# EasyEDA Pro project sarah.eprj, board Cockpit
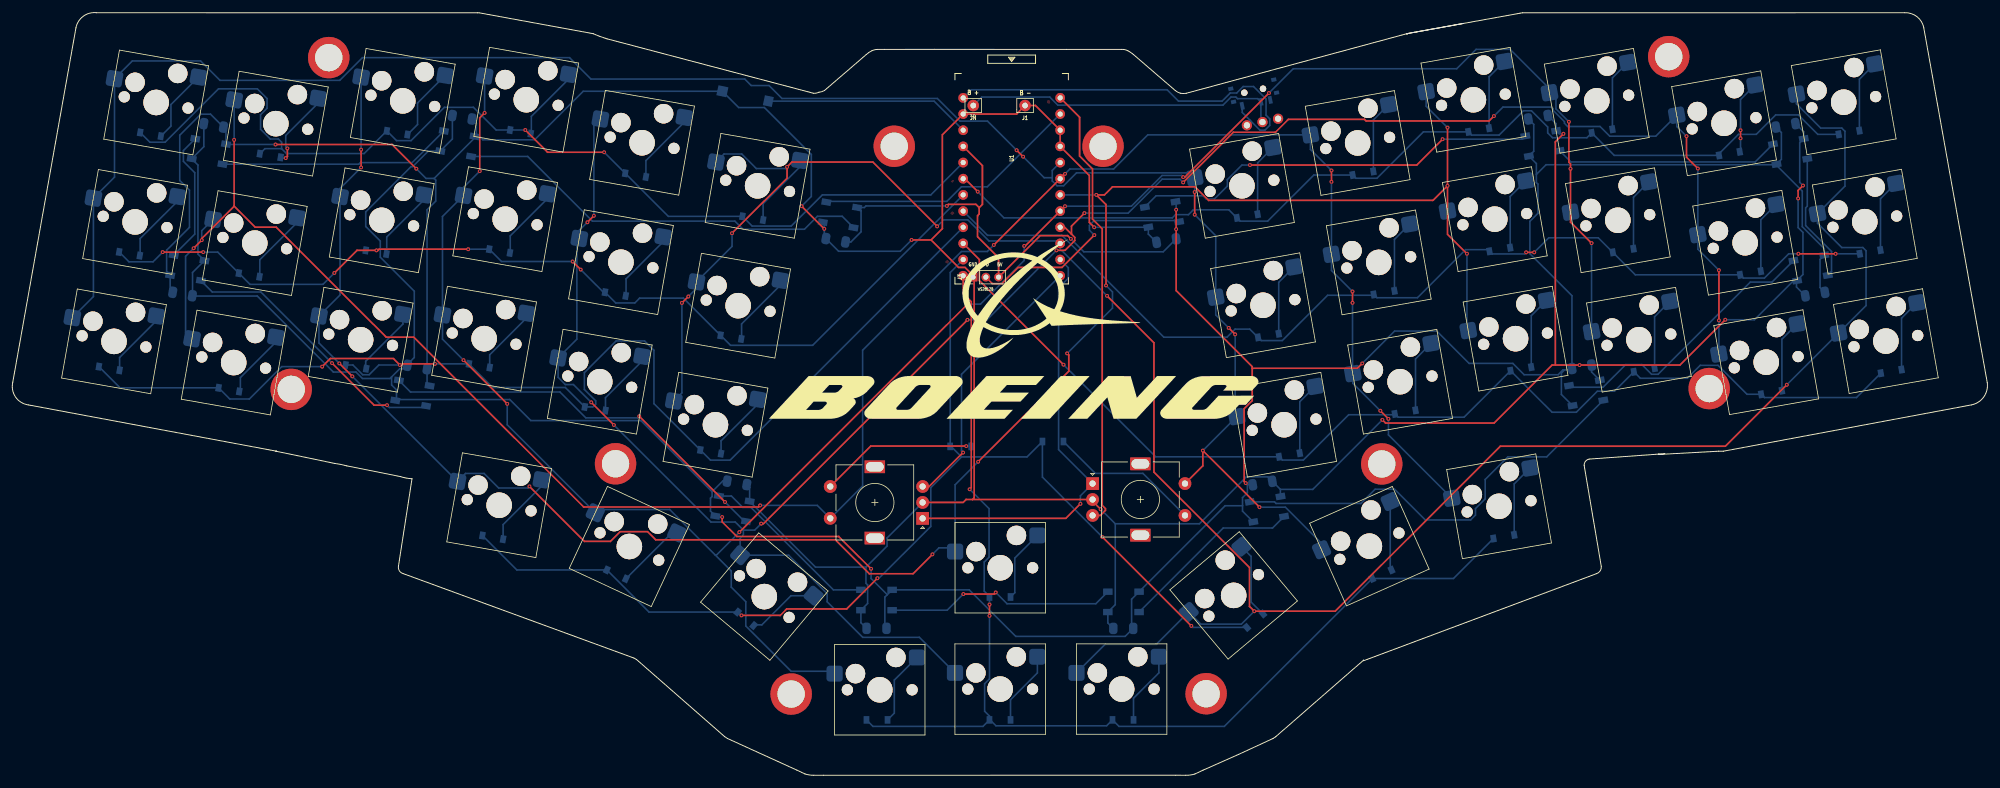
[diagram p1: board, top side]
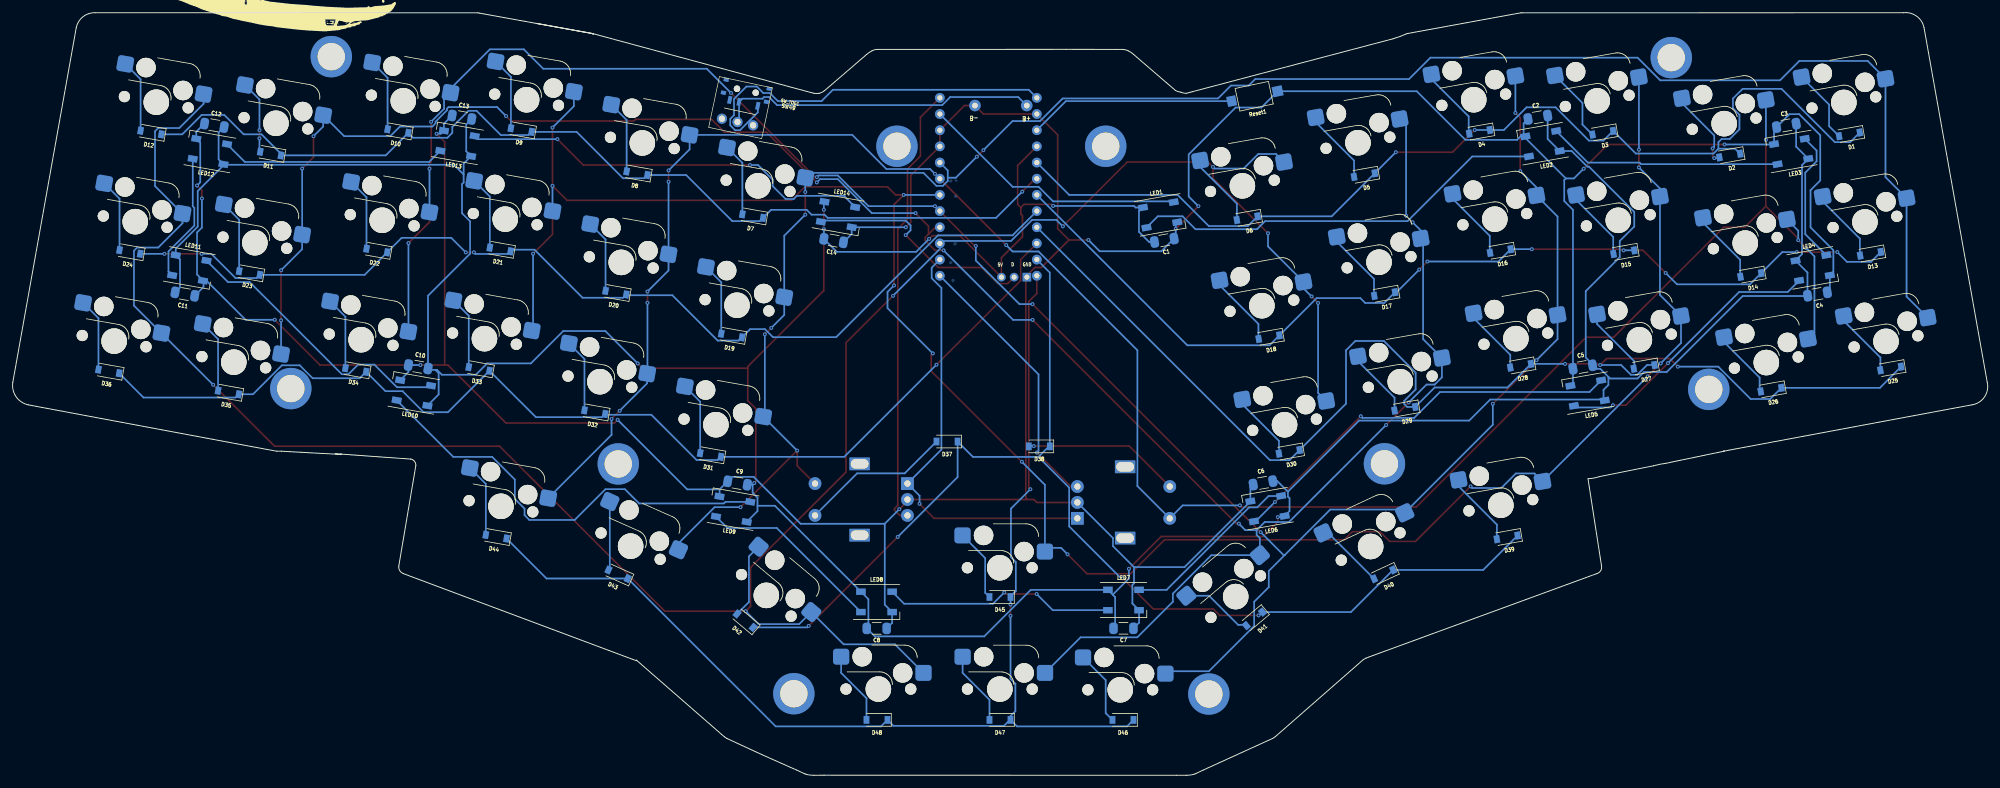
[diagram p2: board, bottom side, seen from below]

Outline 309.97 x 119.78 mm; copper layers: Top Layer, Bottom Layer. Coordinates in mm from the lower left corner of the outline.
Outline path: 41.39,50.91 2.49,58.17 arc(0.51,59.41) 0.07,61.7 9.99,117.41 arc(11.16,119.22) 13.25,119.76 73,119.75 73.26,119.75 91.15,116.47 arc(92.23,116.03) 93.34,115.66 125.75,107.11 arc(126.19,107.14) 126.61,107.28 arc(127.04,107.36) 127.45,107.53 134.02,113.19 arc(134.43,113.52) 134.9,113.79 arc(135.36,113.94) 135.84,114 136.86,114 144.66,114.01 165.44,114 174.13,114 arc(174.61,113.95) 175.07,113.79 arc(175.53,113.52) 175.95,113.19 182.52,107.53 arc(182.9,107.28) 183.33,107.11 arc(183.77,107.07) 184.22,107.11 218.82,116.46 ; 41.39,50.91 41.46,50.9 arc(41.43,50.94) 41.39,50.91 ; 41.39,50.91 arc(41.39,50.9) 41.39,50.89 50.54,48.99 arc(51.5,48.83) 52.44,48.6 60.93,46.91 arc(61.82,46.68) 62.73,46.57 60.61,32.87 arc(60.74,32.13) 61.33,31.68 97.55,18.41 97.98,18.17 111.81,6.06 112.23,5.78 123.12,0.81 124.39,0.21 arc(125.08,0.05) 125.79,0 127.34,0 182.6,0.01 184.18,0 arc(184.89,0.04) 185.58,0.2 186.89,0.81 192.45,3.28 197.89,5.8 198.27,6.05 212.06,18.08 212.08,18 248.64,31.68 arc(249.2,32.13) 249.36,32.82 246.68,48.68 arc(246.9,49.32) 247.48,49.66 258.39,50.44 ; 218.82,116.46 arc(218.82,116.46) 218.82,116.47 ; 218.82,116.46 218.91,116.49 218.93,116.49 arc(218.9,116.37) 218.82,116.46 ; 218.82,116.47 227.74,118.08 218.82,116.47 ; 218.82,116.47 236.65,119.69 236.97,119.75 297.02,119.76 arc(298.93,119.13) 299.98,117.41 309.94,61.66 arc(309.4,59.42) 307.47,58.17 268.51,50.89 arc(268.13,50.89) 267.75,50.89 258.31,50.38 arc(258.35,50.41) 258.39,50.44 ; 258.39,50.44 259.33,50.51 arc(258.87,50.39) 258.39,50.44
Stack: Top Layer 0.0009mm / dielectric 1 0.0384mm FR4 er 4.5 / Bottom Layer 0.0009mm

## Design rules (mm)
spacing safeClearance (default): track to track 0.152, other pairs 0.152 to 0.3
track width trackWidth (default): min 0.127, default 0.254, max 2.54
differential pair differentialPair (default): width min 0.127, default 0.254, max 2.54; gap min 0.152, default 0.152
via viaSize (default): diameter min 0.5, default 0.61, max 10; hole min 0.3, default 0.305, max 6
net COL3 uses CopperRegion517
net ROW6 uses CopperRegion506
net Net-(J2-Pad1) uses CopperRegion393
net COL2 uses CopperRegion507
net RAW uses CopperRegion371
net COL1 uses CopperRegion491
net COL5 uses CopperRegion503
net RST uses CopperRegion444
net COL0 uses CopperRegion471
net Net-(D38-Pad2) uses CopperRegion384
net ROW5 uses CopperRegion438
net COL4 uses CopperRegion482
net ROW0 uses CopperRegion509
net D3 uses CopperRegion355
net ROW1 uses CopperRegion514
net ROW4 uses CopperRegion515
net ROW7 uses CopperRegion502
net D2 uses CopperRegion419
net DOUT uses CopperRegion493
net ROW3 uses CopperRegion485
net ROW2 uses CopperRegion513
net GND uses CopperRegion111
net VCC uses CopperRegion511
net Net-(D33-Pad2) uses CopperRegion294
net Net-(D4-Pad2) uses CopperRegion504
net Net-(D14-Pad2) uses CopperRegion167
net Net-(D28-Pad2) uses CopperRegion210
net Net-(D25-Pad2) uses CopperRegion228
net Net-(LED8-Pad2) uses CopperRegion290
net Net-(LED3-Pad2) uses CopperRegion310
net Net-(D19-Pad2) uses CopperRegion490
net Net-(D46-Pad2) uses CopperRegion293
net Net-(D17-Pad2) uses CopperRegion462
net Net-(D43-Pad2) uses CopperRegion353
net Net-(LED4-Pad2) uses CopperRegion499
net B4 uses CopperRegion436
net Net-(D30-Pad2) uses CopperRegion356
net Net-(D15-Pad2) uses CopperRegion501
net Net-(D24-Pad2) uses CopperRegion257
net Net-(LED12-Pad2) uses CopperRegion318
net Net-(D7-Pad2) uses CopperRegion410
net Net-(LED10-Pad2) uses CopperRegion373
net Net-(D1-Pad2) uses CopperRegion279
net Net-(LED7-Pad2) uses CopperRegion241
net Net-(D12-Pad2) uses CopperRegion272
net Net-(D48-Pad2) uses CopperRegion320
net Net-(D35-Pad2) uses CopperRegion285
net Net-(LED11-Pad2) uses CopperRegion466
net Net-(LED5-Pad2) uses CopperRegion483
net Net-(LED13-Pad2) uses CopperRegion251
net Net-(D36-Pad2) uses CopperRegion344
net Net-(D5-Pad2) uses CopperRegion447
net Net-(D20-Pad2) uses CopperRegion467
net Net-(D31-Pad2) uses CopperRegion337
net Net-(D26-Pad2) uses CopperRegion327
net Net-(LED10-Pad4) uses CopperRegion339
net Net-(D47-Pad2) uses CopperRegion232
net Net-(D39-Pad2) uses CopperRegion488
net Net-(D32-Pad2) uses CopperRegion431
net Net-(D45-Pad2) uses CopperRegion382
net Net-(D10-Pad2) uses CopperRegion246
net Net-(D44-Pad2) uses CopperRegion335
net Net-(D22-Pad2) uses CopperRegion305
net Net-(D8-Pad2) uses CopperRegion454
net Net-(LED1-Pad2) uses CopperRegion324
net Net-(D27-Pad2) uses CopperRegion306
net Net-(D9-Pad2) uses CopperRegion401
net Net-(D21-Pad2) uses CopperRegion400
net Net-(LED6-Pad2) uses CopperRegion346
net Net-(D42-Pad2) uses CopperRegion407
net Net-(D40-Pad2) uses CopperRegion430
net Net-(D23-Pad2) uses CopperRegion457
net Net-(D6-Pad2) uses CopperRegion480
net Net-(D18-Pad2) uses CopperRegion425
net B5 uses CopperRegion481
net Net-(LED2-Pad2) uses CopperRegion477
net Net-(D11-Pad2) uses CopperRegion443
net Net-(D41-Pad2) uses CopperRegion363
net Net-(D37-Pad2) uses CopperRegion381
net Net-(D2-Pad2) uses CopperRegion487
net Net-(D3-Pad2) uses CopperRegion440
net Net-(D16-Pad2) uses CopperRegion508
net Net-(D34-Pad2) uses CopperRegion516
net Net-(D29-Pad2) uses CopperRegion475
net Net-(D13-Pad2) uses CopperRegion426
pour ie2711 uses CopperRegion149
pour ie2716 uses CopperRegion481
pour ie2746 uses CopperRegion62
pour ie2762 uses CopperRegion358
pour ie2769 uses CopperRegion469
pour ie2796 uses CopperRegion461
pour ie2879 uses CopperRegion414
pour ie2887 uses CopperRegion16
pour ie2892 uses CopperRegion33
pour ie2898 uses CopperRegion279
pour ie2902 uses CopperRegion246
pour ie2906 uses CopperRegion272
pour ie2914 uses CopperRegion508
pour ie2919 uses CopperRegion139
pour ie2930 uses CopperRegion457
pour ie2939 uses CopperRegion124
pour ie2943 uses CopperRegion380
pour ie2953 uses CopperRegion408
pour ie2954 uses CopperRegion516
pour ie2955 uses CopperRegion183
pour ie2969 uses CopperRegion303
pour ie2980 uses CopperRegion382
pour ie2982 uses CopperRegion293
pour ie2983 uses CopperRegion216
pour ie2991 uses CopperRegion163
pour ie2993 uses CopperRegion260
pour ie2998 uses CopperRegion92
pour ie3000 uses CopperRegion266
pour ie3002 uses CopperRegion166
pour ie3005 uses CopperRegion339
pour ie3006 uses CopperRegion189
pour ie3013 uses CopperRegion477
pour ie3015 uses CopperRegion310
pour ie3021 uses CopperRegion346
pour ie3025 uses CopperRegion290
pour ie3034 uses CopperRegion199
pour ie3035 uses CopperRegion222
pour ie3037 uses CopperRegion233
pour ie3045 uses CopperRegion32
pour ie3049 uses CopperRegion122
pour ie3053 uses CopperRegion197
pour ie3054 uses CopperRegion271
pour ie3060 uses CopperRegion422
pour ie3072 uses CopperRegion159
pour ie3080 uses CopperRegion513
pour ie3081 uses CopperRegion31
pour ie3085 uses CopperRegion116
pour ie3088 uses CopperRegion158
pour ie3090 uses CopperRegion177
pour ie3091 uses CopperRegion196
pour ie3093 uses CopperRegion238
pour ie3099 uses CopperRegion70
pour ie3100 uses CopperRegion88
pour ie3124 uses CopperRegion69
pour ie3142 uses CopperRegion5
pour ie3164 uses CopperRegion218
pour ie3169 uses CopperRegion415
pour ie3191 uses CopperRegion219
pour ie3209 uses CopperRegion331

## Placement (name value [footprint] x y rotation side)
C1  C1206C105K5RACTU  [Capacitor_SMD:C_1206_3216Metric_Pad1.33x1.80mm_HandSolder]  129.22 84.02 350 bottom
C2  C1206C105K5RACTU  [Capacitor_SMD:C_1206_3216Metric_Pad1.33x1.80mm_HandSolder]  70.6 103.34 170 bottom
C3  C1206C105K5RACTU  [Capacitor_SMD:C_1206_3216Metric_Pad1.33x1.80mm_HandSolder]  31.6 102.07 170 bottom
C4  C1206C105K5RACTU  [Capacitor_SMD:C_1206_3216Metric_Pad1.33x1.80mm_HandSolder]  26.71 75.58 350 bottom
C5  C1206C105K5RACTU  [Capacitor_SMD:C_1206_3216Metric_Pad1.33x1.80mm_HandSolder]  63.55 64.12 170 bottom
C6  C1206C105K5RACTU  [Capacitor_SMD:C_1206_3216Metric_Pad1.33x1.80mm_HandSolder]  113.73 45.92 170 bottom
C7  C1206C105K5RACTU  [Capacitor_SMD:C_1206_3216Metric_Pad1.33x1.80mm_HandSolder]  135.63 23.08 0 bottom
C8  C1206C105K5RACTU  [Capacitor_SMD:C_1206_3216Metric_Pad1.33x1.80mm_HandSolder]  174.35 23.06 0 bottom
C9  C1206C105K5RACTU  [Capacitor_SMD:C_1206_3216Metric_Pad1.33x1.80mm_HandSolder]  196.2 45.9 190 bottom
C10  C1206C105K5RACTU  [Capacitor_SMD:C_1206_3216Metric_Pad1.33x1.80mm_HandSolder]  246.31 64.15 190 bottom
C11  C1206C105K5RACTU  [Capacitor_SMD:C_1206_3216Metric_Pad1.33x1.80mm_HandSolder]  282.92 75.57 10 bottom
C12  C1206C105K5RACTU  [Capacitor_SMD:C_1206_3216Metric_Pad1.33x1.80mm_HandSolder]  278.31 102.08 190 bottom
C13  C1206C105K5RACTU  [Capacitor_SMD:C_1206_3216Metric_Pad1.33x1.80mm_HandSolder]  239.45 103.35 190 bottom
C14  C1206C105K5RACTU  [Capacitor_SMD:C_1206_3216Metric_Pad1.33x1.80mm_HandSolder]  181.11 83.97 10 bottom
D1  1N4148W  [Diode_SMD:D_SOD-123]  21.7 100.66 350 bottom
D2  1N4148W  [Diode_SMD:D_SOD-123]  40.48 97.34 350 bottom
D3  1N4148W  [Diode_SMD:D_SOD-123]  60.4 100.92 350 bottom
D4  1N4148W  [Diode_SMD:D_SOD-123]  79.75 101.06 350 bottom
D5  1N4148W  [Diode_SMD:D_SOD-123]  97.81 94.26 350 bottom
D6  1N4148W  [Diode_SMD:D_SOD-123]  116.21 87.49 350 bottom
D7  1N4148W  [Diode_SMD:D_SOD-123]  193.81 87.83 10 bottom
D8  1N4148W  [Diode_SMD:D_SOD-123]  211.98 94.56 10 bottom
D9  1N4148W  [Diode_SMD:D_SOD-123]  230.14 101.34 10 bottom
D10  1N4148W  [Diode_SMD:D_SOD-123]  249.49 101.17 10 bottom
D11  1N4148W  [Diode_SMD:D_SOD-123]  269.47 97.64 10 bottom
D12  1N4148W  [Diode_SMD:D_SOD-123]  288.25 100.95 10 bottom
D13  1N4148W  [Diode_SMD:D_SOD-123]  18.39 81.9 350 bottom
D14  1N4148W  [Diode_SMD:D_SOD-123]  37.17 78.58 350 bottom
D15  1N4148W  [Diode_SMD:D_SOD-123]  57.09 82.15 350 bottom
D16  1N4148W  [Diode_SMD:D_SOD-123]  76.47 82.33 350 bottom
D17  1N4148W  [Diode_SMD:D_SOD-123]  94.64 75.58 350 bottom
D18  1N4148W  [Diode_SMD:D_SOD-123]  112.78 68.81 350 bottom
D19  1N4148W  [Diode_SMD:D_SOD-123]  197.12 69.06 10 bottom
D20  1N4148W  [Diode_SMD:D_SOD-123]  215.28 75.79 10 bottom
D21  1N4148W  [Diode_SMD:D_SOD-123]  233.45 82.58 10 bottom
D22  1N4148W  [Diode_SMD:D_SOD-123]  252.8 82.41 10 bottom
D23  1N4148W  [Diode_SMD:D_SOD-123]  272.78 78.88 10 bottom
D24  1N4148W  [Diode_SMD:D_SOD-123]  291.56 82.19 10 bottom
D25  1N4148W  [Diode_SMD:D_SOD-123]  15.21 63.89 350 bottom
D26  1N4148W  [Diode_SMD:D_SOD-123]  34 60.57 350 bottom
D27  1N4148W  [Diode_SMD:D_SOD-123]  53.92 64.14 350 bottom
D28  1N4148W  [Diode_SMD:D_SOD-123]  73.3 64.32 350 bottom
D29  1N4148W  [Diode_SMD:D_SOD-123]  91.46 57.57 350 bottom
D30  1N4148W  [Diode_SMD:D_SOD-123]  109.6 50.8 350 bottom
D31  1N4148W  [Diode_SMD:D_SOD-123]  200.43 50.3 10 bottom
D32  1N4148W  [Diode_SMD:D_SOD-123]  218.59 57.03 10 bottom
D33  1N4148W  [Diode_SMD:D_SOD-123]  236.75 63.82 10 bottom
D34  1N4148W  [Diode_SMD:D_SOD-123]  256.11 63.65 10 bottom
D35  1N4148W  [Diode_SMD:D_SOD-123]  276.09 60.12 10 bottom
D36  1N4148W  [Diode_SMD:D_SOD-123]  294.87 63.43 10 bottom
D37  1N4148W  [Diode_SMD:D_SOD-123]  163.31 52.41 0 bottom
D38  1N4148W  [Diode_SMD:D_SOD-123]  148.84 51.65 0 bottom
D39  1N4148W  [Diode_SMD:D_SOD-123]  75.4 37.37 350 bottom
D40  1N4148W  [Diode_SMD:D_SOD-123]  94.8 31.56 335 bottom
D41  1N4148W  [Diode_SMD:D_SOD-123]  115.09 24.57 320 bottom
D42  1N4148W  [Diode_SMD:D_SOD-123]  195.01 24.28 40 bottom
D43  1N4148W  [Diode_SMD:D_SOD-123]  214.94 31.57 24 bottom
D44  1N4148W  [Diode_SMD:D_SOD-123]  234.08 37.47 10 bottom
D45  1N4148W  [Diode_SMD:D_SOD-123]  155.01 28 0 bottom
D46  1N4148W  [Diode_SMD:D_SOD-123]  135.7 8.7 0 bottom
D47  1N4148W  [Diode_SMD:D_SOD-123]  155.01 8.7 0 bottom
D48  1N4148W  [Diode_SMD:D_SOD-123]  174.31 8.7 0 bottom
H1  MountingHole  [kbd:M2_HOLE]  214.92 48.9 0 top
H2  MountingHole  [kbd:M2_HOLE]  49.66 112.71 0 top
H3  MountingHole  [kbd:M2_HOLE]  259.95 112.86 0 top
H4  MountingHole  [kbd:M2_HOLE]  187.36 12.81 0 top
H5  MountingHole  [kbd:M2_HOLE]  122.23 12.76 0 top
H6  MountingHole  [kbd:M2_HOLE]  138.41 98.79 0 top
H7  MountingHole  [kbd:M2_HOLE]  94.67 48.92 0 top
H8  MountingHole  [kbd:M2_HOLE]  266.3 60.73 0 top
H9  MountingHole  [kbd:M2_HOLE]  43.77 60.61 0 top
H10  MountingHole  [kbd:M2_HOLE]  171.18 98.79 0 top
J1  Conn_01x01_Female  [Connector_Pin:Pin_D0.9mm_L10.0mm_W2.4mm_FlatFork]  158.94 105.18 0 top
J3  Conn_01x03_Female  [Connector_PinHeader_2.00mm:PinHeader_1x03_P2.00mm_Vertical]  150.79 78.23 90 top
JN  Conn_01x01_Female  [Connector_Pin:Pin_D0.9mm_L10.0mm_W2.4mm_FlatFork]  150.81 105.18 0 top
LED1  WS2812B  [LED_SMD:LED_WS2812B_PLCC4_5.0x5.0mm_P3.2mm]  129.88 88.01 170 bottom
LED2  WS2812B  [LED_SMD:LED_WS2812B_PLCC4_5.0x5.0mm_P3.2mm]  69.86 99.19 350 bottom
LED3  WS2812B  [LED_SMD:LED_WS2812B_PLCC4_5.0x5.0mm_P3.2mm]  30.85 97.97 350 bottom
LED4  WS2812B  [LED_SMD:LED_WS2812B_PLCC4_5.0x5.0mm_P3.2mm]  27.47 79.68 170 bottom
LED5  WS2812B  [LED_SMD:LED_WS2812B_PLCC4_5.0x5.0mm_P3.2mm]  62.8 60.02 350 bottom
LED6  WS2812B  [LED_SMD:LED_WS2812B_PLCC4_5.0x5.0mm_P3.2mm]  113.02 41.87 350 bottom
LED7  WS2812B  [LED_SMD:LED_WS2812B_PLCC4_5.0x5.0mm_P3.2mm]  135.63 27.52 180 bottom
LED8  WS2812B  [LED_SMD:LED_WS2812B_PLCC4_5.0x5.0mm_P3.2mm]  174.38 27.23 180 bottom
LED9  WS2812B  [LED_SMD:LED_WS2812B_PLCC4_5.0x5.0mm_P3.2mm]  196.89 41.79 10 bottom
LED10  WS2812B  [LED_SMD:LED_WS2812B_PLCC4_5.0x5.0mm_P3.2mm]  247 60.05 10 bottom
LED11  WS2812B  [LED_SMD:LED_WS2812B_PLCC4_5.0x5.0mm_P3.2mm]  282.23 79.68 190 bottom
LED12  WS2812B  [LED_SMD:LED_WS2812B_PLCC4_5.0x5.0mm_P3.2mm]  279 97.97 10 bottom
LED13  WS2812B  [LED_SMD:LED_WS2812B_PLCC4_5.0x5.0mm_P3.2mm]  240.14 99.24 10 bottom
LED14  WS2812B  [LED_SMD:LED_WS2812B_PLCC4_5.0x5.0mm_P3.2mm]  180.42 88.08 190 bottom
Reset1  SW_KBD  [kbd:SW_SPST_RS-282G05A3-SM]  115.01 106.67 168 bottom
SW1  MX_SW_HS  [Switch_Keyboard_Hotswap_Kailh:SW_Hotswap_Kailh_MX_1.00u]  22.58 105.66 350 top
SW2  MX_SW_HS  [Switch_Keyboard_Hotswap_Kailh:SW_Hotswap_Kailh_MX_1.00u]  41.36 102.34 350 top
SW3  MX_SW_HS  [Switch_Keyboard_Hotswap_Kailh:SW_Hotswap_Kailh_MX_1.00u]  61.28 105.92 350 top
SW4  MX_SW_HS  [Switch_Keyboard_Hotswap_Kailh:SW_Hotswap_Kailh_MX_1.00u]  80.66 106.1 350 top
SW5  MX_SW_HS  [Switch_Keyboard_Hotswap_Kailh:SW_Hotswap_Kailh_MX_1.00u]  98.83 99.34 350 top
SW6  MX_SW_HS  [Switch_Keyboard_Hotswap_Kailh:SW_Hotswap_Kailh_MX_1.00u]  116.97 92.57 350 top
SW7  MX_SW_HS  [Switch_Keyboard_Hotswap_Kailh:SW_Hotswap_Kailh_MX_1.00u]  192.98 92.58 10 top
SW8  MX_SW_HS  [Switch_Keyboard_Hotswap_Kailh:SW_Hotswap_Kailh_MX_1.00u]  211.14 99.31 10 top
SW9  MX_SW_HS  [Switch_Keyboard_Hotswap_Kailh:SW_Hotswap_Kailh_MX_1.00u]  229.3 106.09 10 top
SW10  MX_SW_HS  [Switch_Keyboard_Hotswap_Kailh:SW_Hotswap_Kailh_MX_1.00u]  248.65 105.93 10 top
SW11  MX_SW_HS  [Switch_Keyboard_Hotswap_Kailh:SW_Hotswap_Kailh_MX_1.00u]  268.64 102.4 10 top
SW12  MX_SW_HS  [Switch_Keyboard_Hotswap_Kailh:SW_Hotswap_Kailh_MX_1.00u]  287.41 105.71 10 top
SW13  MX_SW_HS  [Switch_Keyboard_Hotswap_Kailh:SW_Hotswap_Kailh_MX_1.00u]  19.27 86.9 350 top
SW14  MX_SW_HS  [Switch_Keyboard_Hotswap_Kailh:SW_Hotswap_Kailh_MX_1.00u]  38.05 83.58 350 top
SW15  MX_SW_HS  [Switch_Keyboard_Hotswap_Kailh:SW_Hotswap_Kailh_MX_1.00u]  57.98 87.16 350 top
SW16  MX_SW_HS  [Switch_Keyboard_Hotswap_Kailh:SW_Hotswap_Kailh_MX_1.00u]  77.36 87.34 350 top
SW17  MX_SW_HS  [Switch_Keyboard_Hotswap_Kailh:SW_Hotswap_Kailh_MX_1.00u]  95.52 80.58 350 top
SW18  MX_SW_HS  [Switch_Keyboard_Hotswap_Kailh:SW_Hotswap_Kailh_MX_1.00u]  113.91 73.75 350 top
SW19  MX_SW_HS  [Switch_Keyboard_Hotswap_Kailh:SW_Hotswap_Kailh_MX_1.00u]  196.28 73.82 10 top
SW20  MX_SW_HS  [Switch_Keyboard_Hotswap_Kailh:SW_Hotswap_Kailh_MX_1.00u]  214.45 80.55 10 top
SW21  MX_SW_HS  [Switch_Keyboard_Hotswap_Kailh:SW_Hotswap_Kailh_MX_1.00u]  232.66 87.34 10 top
SW22  MX_SW_HS  [Switch_Keyboard_Hotswap_Kailh:SW_Hotswap_Kailh_MX_1.00u]  251.96 87.17 10 top
SW23  MX_SW_HS  [Switch_Keyboard_Hotswap_Kailh:SW_Hotswap_Kailh_MX_1.00u]  271.94 83.64 10 top
SW24  MX_SW_HS  [Switch_Keyboard_Hotswap_Kailh:SW_Hotswap_Kailh_MX_1.00u]  290.72 86.95 10 top
SW25  MX_SW_HS  [Switch_Keyboard_Hotswap_Kailh:SW_Hotswap_Kailh_MX_1.00u]  15.96 68.14 350 top
SW26  MX_SW_HS  [Switch_Keyboard_Hotswap_Kailh:SW_Hotswap_Kailh_MX_1.00u]  34.75 64.82 350 top
SW27  MX_SW_HS  [Switch_Keyboard_Hotswap_Kailh:SW_Hotswap_Kailh_MX_1.00u]  54.67 68.4 350 top
SW28  MX_SW_HS  [Switch_Keyboard_Hotswap_Kailh:SW_Hotswap_Kailh_MX_1.00u]  74.05 68.57 350 top
SW29  MX_SW_HS  [Switch_Keyboard_Hotswap_Kailh:SW_Hotswap_Kailh_MX_1.00u]  92.19 61.81 350 top
SW30  MX_SW_HS  [Switch_Keyboard_Hotswap_Kailh:SW_Hotswap_Kailh_MX_1.00u]  110.35 55.05 350 top
SW31  MX_SW_HS  [Switch_Keyboard_Hotswap_Kailh:SW_Hotswap_Kailh_MX_1.00u]  199.59 55.06 10 top
SW32  MX_SW_HS  [Switch_Keyboard_Hotswap_Kailh:SW_Hotswap_Kailh_MX_1.00u]  217.8 61.81 10 top
SW33  MX_SW_HS  [Switch_Keyboard_Hotswap_Kailh:SW_Hotswap_Kailh_MX_1.00u]  235.92 68.57 10 top
SW34  MX_SW_HS  [Switch_Keyboard_Hotswap_Kailh:SW_Hotswap_Kailh_MX_1.00u]  255.27 68.41 10 top
SW35  MX_SW_HS  [Switch_Keyboard_Hotswap_Kailh:SW_Hotswap_Kailh_MX_1.00u]  275.25 64.88 10 top
SW36  MX_SW_HS  [Switch_Keyboard_Hotswap_Kailh:SW_Hotswap_Kailh_MX_1.00u]  294.03 68.18 10 top
SW37  RotaryEncoder_Switch  [Rotary_Encoder:RotaryEncoder_Alps_EC11E-Switch_Vertical_H20mm]  169.54 45.81 0 top
SW38  RotaryEncoder_Switch  [Rotary_Encoder:RotaryEncoder_Alps_EC11E-Switch_Vertical_H20mm]  142.87 40.35 180 top
SW39  MX_SW_HS  [Switch_Keyboard_Hotswap_Kailh:SW_Hotswap_Kailh_MX_1.00u]  76.41 42.41 350 top
SW40  MX_SW_HS  [Switch_Keyboard_Hotswap_Kailh:SW_Hotswap_Kailh_MX_1.00u]  96.84 35.93 335 top
SW41  MX_SW_HS  [Switch_Keyboard_Hotswap_Kailh:SW_Hotswap_Kailh_MX_1.50u_90deg]  118.02 28.06 320 top
SW42  MX_SW_HS  [Switch_Keyboard_Hotswap_Kailh:SW_Hotswap_Kailh_MX_1.50u_90deg]  191.68 28.25 40 top
SW43  MX_SW_HS  [Switch_Keyboard_Hotswap_Kailh:SW_Hotswap_Kailh_MX_1.00u]  212.98 35.98 24 top
SW44  MX_SW_HS  [Switch_Keyboard_Hotswap_Kailh:SW_Hotswap_Kailh_MX_1.00u]  233.33 42.24 10 top
SW45  MX_SW_HS  [Switch_Keyboard_Hotswap_Kailh:SW_Hotswap_Kailh_MX_1.00u]  155.05 32.59 0 top
SW46  MX_SW_HS  [Switch_Keyboard_Hotswap_Kailh:SW_Hotswap_Kailh_MX_1.00u]  136.14 13.43 0 top
SW47  MX_SW_HS  [Switch_Keyboard_Hotswap_Kailh:SW_Hotswap_Kailh_MX_1.00u]  155.03 13.53 0 top
SW48  MX_SW_HS  [Switch_Keyboard_Hotswap_Kailh:SW_Hotswap_Kailh_MX_1.00u]  174.1 13.54 0 top
SW49  MSK12C02  [kbd:MSK12C02]  195.95 105.75 12 bottom
SW_TOG1  SS12D00  [kbd:SS12D00]  196.2 102.59 12 bottom
U1  ProMicro  [kbd:ProMicro_v3.5]  156.84 91.91 0 top

## Footprints (pads in the part's own frame, mm; a bottom-side part is the same pattern mirrored in y, then rotated)
Capacitor_SMD:C_1206_3216Metric_Pad1.33x1.80mm_HandSolder
  rrect 1.325x1.8 smd: 1(-1.562,0) 2(1.562,0)
Connector_Pin:Pin_D0.9mm_L10.0mm_W2.4mm_FlatFork
  round 1.8 hole 0.9: 1(0,0)
Connector_PinHeader_2.00mm:PinHeader_1x03_P2.00mm_Vertical
  rect 1.35x1.35 hole 0.8: 1(0,0)
  round 1.35 hole 0.8: 2(0,-2) 3(0,-4)
Diode_SMD:D_SOD-123
  rect 0.9x1.2 smd: 1(-1.65,0) 2(1.65,0)
kbd:M2_HOLE
  round 6.5 hole 4.3: (0,0)
kbd:MSK12C02
  rect 0.8x0.6 smd: (-4.2,-3) (-4.2,-0.9) (2.7,-3) (2.7,-0.9)
  round 1 hole 1: (-2.25,-1.95) (0.75,-1.95)
  rect 0.6x1.2 smd: 1(1.5,0) 2(0,0) 3(-3,0)
kbd:ProMicro_v3.5
  round 1.524 hole 0.813: 1(7.612,14.478) 2(7.612,11.938) 3(7.612,9.398) 4(7.612,6.858) 5(7.612,4.318) 6(7.612,1.778) 7(7.612,-0.762) 8(7.612,-3.302) 9(7.612,-5.842) 10(7.612,-8.382) 11(7.612,-10.922) 12(7.612,-13.462) 13(-7.609,-13.462) 14(-7.609,-10.922) 15(-7.609,-8.382) 16(-7.609,-5.842) 17(-7.609,-3.302) 18(-7.609,-0.762) 19(-7.609,1.778) 20(-7.609,4.318) 21(-7.609,6.858) 22(-7.609,9.398) 23(-7.609,11.938) 24(-7.609,14.478)
kbd:SS12D00
  round 1.6 hole 1: 1(-2.5,0) 2(0,0) 3(2.5,0)
kbd:SW_SPST_RS-282G05A3-SM
  rect 1.435x1.59 smd: 1(-3.728,-0.025)
  rect 1.595x1.6 smd: 2(3.647,-0.01)
LED_SMD:LED_WS2812B_PLCC4_5.0x5.0mm_P3.2mm
  rect 1.5x1 smd: 1(-2.45,1.6) 2(-2.45,-1.6) 3(2.45,-1.6) 4(2.45,1.6)
Rotary_Encoder:RotaryEncoder_Alps_EC11E-Switch_Vertical_H20mm
  rect 2x2 hole 1: A(0,0)
  round 2 hole 1: B(0,-5) C(0,-2.5) S1(14.5,-5) S2(14.5,0)
  rect 3.2x2 hole 2.8x1.5: MP(7.5,3.1) MP(7.5,-8.1)
Switch_Keyboard_Hotswap_Kailh:SW_Hotswap_Kailh_MX_1.00u
  round 1.75 hole 1.75: (-5.08,0) (5.08,0)
  round 3.05 hole 3.05: (-3.81,2.54) (2.54,5.08)
  round 4 hole 4: (0,0)
  rrect 2.55x2.5 smd far side: 1(-7.085,2.54) 2(5.842,5.08)
Switch_Keyboard_Hotswap_Kailh:SW_Hotswap_Kailh_MX_1.50u_90deg
  round 1.75 hole 1.75: (-5.08,0) (5.08,0)
  round 3.05 hole 3.05: (-3.81,2.54) (2.54,5.08)
  round 4 hole 4: (0,0)
  rrect 2.55x2.5 smd far side: 1(-7.085,2.54) 2(5.842,5.08)

## Nets
GND: C1.1 C2.1 C3.1 C4.1 C5.1 C6.1 C7.1 C8.1 C9.1 C10.1 C11.1 C12.1 C13.1 C14.1 J1.1 J3.1 LED1.3 LED2.3 LED3.3 LED4.3 LED5.3 LED6.3 LED7.3 LED8.3 LED9.3 LED10.3 LED11.3 LED12.3 LED13.3 LED14.3 Reset1.2 SW37.C SW38.C U1.3 U1.4 U1.23
VCC: C1.2 C2.2 C3.2 C4.2 C5.2 C6.2 C7.2 C8.2 C9.2 C10.2 C11.2 C12.2 C13.2 C14.2 J3.3 LED1.1 LED2.1 LED3.1 LED4.1 LED5.1 LED6.1 LED7.1 LED8.1 LED9.1 LED10.1 LED11.1 LED12.1 LED13.1 LED14.1 U1.21
B4: SW37.A SW38.A U1.11
B5: SW38.B U1.12
COL0: SW1.1 SW7.1 SW13.1 SW19.1 SW25.1 SW31.1 SW37.S2 SW43.1 U1.5
COL1: SW2.1 SW8.1 SW14.1 SW20.1 SW26.1 SW32.1 SW38.S2 SW44.1 U1.6
COL2: SW3.1 SW9.1 SW15.1 SW21.1 SW27.1 SW33.1 SW39.1 SW45.1 U1.7
COL3: SW4.1 SW10.1 SW16.1 SW22.1 SW28.1 SW34.1 SW40.1 SW46.1 U1.8
COL4: SW5.1 SW11.1 SW17.1 SW23.1 SW29.1 SW35.1 SW41.1 SW47.1 U1.9
COL5: SW6.1 SW12.1 SW18.1 SW24.1 SW30.1 SW36.1 SW42.1 SW48.1 U1.10
D2: LED1.4 U1.2
D3: SW37.B U1.1
DOUT: J3.2 LED14.2
NET-(D1-PAD2): D1.2 SW1.2
NET-(D2-PAD2): D2.2 SW2.2
NET-(D3-PAD2): D3.2 SW3.2
NET-(D4-PAD2): D4.2 SW4.2
NET-(D5-PAD2): D5.2 SW5.2
NET-(D6-PAD2): D6.2 SW6.2
NET-(D7-PAD2): D7.2 SW7.2
NET-(D8-PAD2): D8.2 SW8.2
NET-(D9-PAD2): D9.2 SW9.2
NET-(D10-PAD2): D10.2 SW10.2
NET-(D11-PAD2): D11.2 SW11.2
NET-(D12-PAD2): D12.2 SW12.2
NET-(D13-PAD2): D13.2 SW13.2
NET-(D14-PAD2): D14.2 SW14.2
NET-(D15-PAD2): D15.2 SW15.2
NET-(D16-PAD2): D16.2 SW16.2
NET-(D17-PAD2): D17.2 SW17.2
NET-(D18-PAD2): D18.2 SW18.2
NET-(D19-PAD2): D19.2 SW19.2
NET-(D20-PAD2): D20.2 SW20.2
NET-(D21-PAD2): D21.2 SW21.2
NET-(D22-PAD2): D22.2 SW22.2
NET-(D23-PAD2): D23.2 SW23.2
NET-(D24-PAD2): D24.2 SW24.2
NET-(D25-PAD2): D25.2 SW25.2
NET-(D26-PAD2): D26.2 SW26.2
NET-(D27-PAD2): D27.2 SW27.2
NET-(D28-PAD2): D28.2 SW28.2
NET-(D29-PAD2): D29.2 SW29.2
NET-(D30-PAD2): D30.2 SW30.2
NET-(D31-PAD2): D31.2 SW31.2
NET-(D32-PAD2): D32.2 SW32.2
NET-(D33-PAD2): D33.2 SW33.2
NET-(D34-PAD2): D34.2 SW34.2
NET-(D35-PAD2): D35.2 SW35.2
NET-(D36-PAD2): D36.2 SW36.2
NET-(D37-PAD2): D37.2 SW37.S1
NET-(D38-PAD2): D38.2 SW38.S1
NET-(D39-PAD2): D39.2 SW39.2
NET-(D40-PAD2): D40.2 SW40.2
NET-(D41-PAD2): D41.2 SW41.2
NET-(D42-PAD2): D42.2 SW42.2
NET-(D43-PAD2): D43.2 SW43.2
NET-(D44-PAD2): D44.2 SW44.2
NET-(D45-PAD2): D45.2 SW45.2
NET-(D46-PAD2): D46.2 SW46.2
NET-(D47-PAD2): D47.2 SW47.2
NET-(D48-PAD2): D48.2 SW48.2
NET-(J2-PAD1): JN.1 SW49.2 SW_TOG1.2
NET-(LED1-PAD2): LED1.2 LED2.4
NET-(LED2-PAD2): LED2.2 LED3.4
NET-(LED3-PAD2): LED3.2 LED4.4
NET-(LED4-PAD2): LED4.2 LED5.4
NET-(LED5-PAD2): LED5.2 LED6.4
NET-(LED6-PAD2): LED6.2 LED7.4
NET-(LED7-PAD2): LED7.2 LED8.4
NET-(LED8-PAD2): LED8.2 LED9.4
NET-(LED10-PAD2): LED10.2 LED11.4
NET-(LED10-PAD4): LED9.2 LED10.4
NET-(LED11-PAD2): LED11.2 LED12.4
NET-(LED12-PAD2): LED12.2 LED13.4
NET-(LED13-PAD2): LED13.2 LED14.4
RAW: SW49.3 SW_TOG1.1 U1.24
ROW0: D1.1 D2.1 D3.1 D4.1 D5.1 D6.1 U1.20
ROW1: D7.1 D8.1 D9.1 D10.1 D11.1 D12.1 U1.19
ROW2: D13.1 D14.1 D15.1 D16.1 D17.1 D18.1 U1.18
ROW3: D19.1 D20.1 D21.1 D22.1 D23.1 D24.1 U1.17
ROW4: D25.1 D26.1 D27.1 D28.1 D29.1 D30.1 U1.16
ROW5: D31.1 D32.1 D33.1 D34.1 D35.1 D36.1 U1.15
ROW6: D37.1 D38.1 D39.1 D40.1 D41.1 D42.1 U1.14
ROW7: D43.1 D44.1 D45.1 D46.1 D47.1 D48.1 U1.13
RST: Reset1.1 U1.22
UNCONNECTED-(SW49-PAD1): SW49.1
UNCONNECTED-(SW_TOG1-PAD3): SW_TOG1.3

Pads without a net: SW37 MP; SW38 MP

## Via types
v1: diameter 0.61, hole 0.305, Top Layer to Bottom Layer, 130 vias

## Routing (per net, layer and track width the routed paths; a pad name or vN(x,y) marks a point on that pad's centre or on a via; arc(x,y) is an arc through that point)
GND: length 627.6
  Top Layer w0.254: v1(170.8,41.78) 169.53,43.05 SW37.C 150.69,43.31 ; v1(281.02,92.62) 280.25,91.86 v1(280.25,90.59) ; 144.18,84.07 v1(141.13,84.07) ; 144.18,84.07 148.5,79.76 149.51,79.76 150.78,78.49 J3.1 150.95,78.07 150.95,43.56 150.69,43.31 ; 144.18,84.07 145.96,85.85 145.96,100.58 U1.23 157.6,103.85 J1.1 160.57,105.18 164.45,101.31 U1.4 169.02,94.2 169.02,86.83 v1(169.78,86.07) ; v1(127.43,85.82) v1(123.87,89.37) ; 242.15,64.42 242.15,99.48 v1(243.42,100.75) ; 242.15,64.42 241.65,64.42 232.54,55.31 215.52,55.31 v1(215.01,55.82) ; 242.15,64.42 v1(245.96,64.42) 261.71,64.42 v1(268.82,71.54) ; v1(41.31,99.07) 59.6,99.07 v1(63.4,95.26) ; 150.69,43.31 149.68,43.31 149.21,42.85 SW38.C
  Bottom Layer w0.254: 280,77.63 280,76.68 C11.1 ; 280,77.63 281.02,78.65 281.02,85.25 280.25,86.01 v1(280.25,90.59) ; 280,77.63 LED11.3 ; 280,77.63 279.49,77.63 273.4,71.54 v1(268.82,71.54) ; v1(41.31,99.07) 33.59,99.07 LED3.3 33.53,101.4 C3.1 31.1,103.83 29.58,103.83 26.28,100.52 26.28,93.41 27.8,91.89 27.8,86.05 24.22,82.46 24.22,79.08 LED4.3 24.78,76.25 25.17,75.85 ; SW38.C 137.28,37.26 137.28,35.99 133.97,32.69 ; 133.97,32.69 133.97,30.15 134.23,29.89 134.23,26.97 LED7.3 133.17,23.96 C7.1 ; 133.97,32.69 126.04,32.69 LED6.3 115.71,45.2 115.26,45.65 ; v1(281.02,92.62) 280.51,93.13 280.51,99.34 LED12.3 281.14,101.06 C12.1 ; v1(63.4,95.26) 64.93,93.73 66.2,93.73 ; 199.01,44.9 204.09,44.9 v1(215.01,55.82) ; 199.01,44.9 C9.1 197.04,46.86 193.66,46.86 186.3,39.5 173.09,39.5 ; 199.01,44.9 199.01,43.81 LED9.3 ; 72.83,100.56 72.55,100.34 72.55,100.08 66.2,93.73 ; 72.83,100.56 72.83,102.38 C2.1 ; 72.83,100.56 73.08,100.56 73.85,99.8 81.97,99.8 89.59,107.42 Reset1.2 113.99,104.87 118.03,104.87 125.39,97.5 125.39,90.9 v1(123.87,89.37) ; C13.1 242.28,102.33 242.28,101.24 242.77,100.75 v1(243.42,100.75) ; LED10.3 247.84,63.34 C10.1 v1(245.96,64.42) ; 66.2,93.73 66.45,93.48 66.45,90.18 65.09,88.81 65.09,61.57 LED5.3 ; v1(170.8,41.78) 173.09,39.5 ; 173.09,39.5 173.09,26.79 LED8.3 171.93,23.92 C8.1 ; C14.1 178.28,84.99 LED14.3 178.27,86.07 v1(169.78,86.07) ; v1(141.13,84.07) 139.35,82.3 129.68,82.3 C1.1 127.43,84.55 v1(127.43,85.82) 127.43,86.62 LED1.3
VCC: length 612.8
  Top Layer w0.254: v1(193.57,45.89) 193.32,46.14 193.32,57.57 194.59,58.84 194.59,63.92 ; 151.74,89.15 151.74,88.14 151.48,87.88 151.48,84.58 154.78,81.28 J3.3 161.3,84.75 165.62,84.75 v1(166.13,84.24) ; 151.74,89.15 151.23,89.66 146.91,89.66 v1(146.66,89.42) ; 151.74,89.15 152.24,89.66 152.24,95.75 U1.21 ; v1(211.86,64.69) 211.1,63.92 194.59,63.92 ; 194.59,63.92 194.59,64.18 182.65,76.12 v1(182.65,85.77) v1(182.65,88.82) ; v1(134.77,32.42) 129.69,37.5 113.69,37.5 111.4,39.79 v1(111.4,40.55)
  Bottom Layer w0.254: C6.2 111.48,46.19 109.82,44.53 ; 28.79,75.27 38.45,75.27 50.38,63.33 53.94,63.33 54.96,62.31 59.27,62.31 59.53,62.57 ; 28.79,75.27 28.3,75.27 C4.2 ; 28.79,75.27 28.29,75.77 28.29,78.96 LED4.1 29.14,81.85 29.14,95.83 LED3.1 30.06,98.72 C3.2 ; v1(166.13,84.24) 168.16,82.21 180.62,82.21 182.65,84.24 v1(182.65,85.77) ; C1.2 131.6,83.75 133.2,85.35 133.2,88.65 132.69,89.16 ; v1(182.65,88.82) 182.65,89.98 LED14.1 ; 61.81,64.34 61.31,63.84 60.8,63.84 59.53,62.57 ; 61.81,64.34 C5.2 ; 61.81,64.34 63.08,65.61 63.08,76.03 57.75,81.36 57.75,83.9 55.46,86.19 55.46,88.47 62.58,95.59 62.83,95.59 65.28,98.04 LED2.1 69.06,99.93 C2.2 ; 132.69,89.16 133.71,89.16 133.96,89.42 v1(146.66,89.42) ; 132.69,89.16 132.57,89.16 ; LED9.1 193.06,41.48 193.06,42.33 ; 243.61,63.67 243.1,63.16 243.1,59.81 LED10.1 ; 243.61,63.67 243.36,63.67 242.59,62.91 237.26,62.91 235.48,64.69 228.62,64.69 223.54,69.77 216.94,69.77 v1(211.86,64.69) ; 243.61,63.67 244.55,63.67 C10.2 244.77,75.31 238.16,81.92 238.16,87 239.43,88.27 239.43,92.84 239.18,93.09 239.18,94.36 ; v1(134.77,32.42) 134.77,30.9 137.31,28.36 ; 137.31,28.36 138.08,29.12 150.17,29.12 157.48,21.81 174.64,21.81 175.91,23.08 ; 137.31,28.36 136.93,27.98 136.93,23.33 C7.2 ; v1(193.57,45.89) 193.83,45.64 ; 193.83,45.64 193.83,44.37 193.06,43.6 193.06,42.33 ; 193.83,45.64 194.65,45.64 C9.2 ; 175.91,23.08 C8.2 ; 175.91,23.08 175.91,23.59 175.66,23.85 175.66,27.66 LED8.1 190.33,42.33 193.06,42.33 ; 60.29,59.01 78.07,59.01 81.37,55.71 98.64,55.71 109.82,44.53 ; 60.29,59.01 60.29,60.53 59.53,61.3 59.53,62.57 ; 60.29,59.01 60.11,58.87 ; 239.18,94.36 239.18,96.06 238.01,97.24 238.77,98 238.77,102.22 C13.2 ; 239.18,94.36 240.7,95.89 276.77,95.89 ; 276.77,95.89 280.91,91.75 280.91,86.16 284.36,82.71 LED11.1 283.69,81.02 283.69,76.61 284.46,75.84 ; 276.77,95.89 LED12.1 277.63,96.73 277.63,100.95 276.77,101.8 ; 109.82,44.53 109.82,43.77 109.57,43.52 109.57,41.48 LED6.1 110.5,40.55 v1(111.4,40.55)
B4: length 68.2
  Top Layer w0.254: v1(167.63,42.64) 165.35,40.35 SW38.A
  Bottom Layer w0.254: v1(167.63,42.64) 167.63,43.91 SW37.A 164.2,51.14 164.2,76.54 165.73,78.07 165.73,79.71 U1.11
B5: length 42.8
  Top Layer w0.254: v1(149.21,50.68) 143.88,45.35 SW38.B
  Bottom Layer w0.254: v1(149.21,50.68) 148.96,50.94 148.96,62.96 U1.12
COL0: length 306.2
  Top Layer w0.254: v1(158.63,97.15) v1(157.62,98.17) ; v1(190.9,70.26) v1(191.91,69.24) ; v1(195.73,42.1) v1(186.84,50.99) 186.84,48.61 SW37.S2 ; v1(185.56,88.04) v1(185.56,91.6)
  Bottom Layer w0.254: 185.56,93.85 184.79,94.61 167.01,94.61 164.98,92.58 163.97,92.58 163.2,93.34 163.2,93.85 ; 163.2,93.85 161.93,93.85 v1(158.63,97.15) ; 163.2,93.85 163.2,94.99 U1.5 ; v1(191.91,69.24) 191.91,56.59 192.17,56.33 v1(186.84,50.99) ; v1(185.56,91.6) 185.56,93.84 ; v1(185.56,88.04) 188.86,84.74 188.86,72.29 v1(190.9,70.26) ; v1(195.73,42.1) 199.79,42.1 205.38,36.51 205.38,35.51 SW43.1 ; v1(157.62,98.17) 153.04,102.74 148.73,102.74 145.17,106.29 120.79,106.29 118.75,108.33 115.96,108.33 114.94,109.34 90.81,109.34 87.46,112.7 54.95,112.7 51.39,109.14 32.59,109.14 29.55,112.19 18.84,112.19 16.04,109.39 16.04,93.94 12.73,90.63 12.73,75.18 9.43,71.87
COL1: length 338.2
  Top Layer w0.254: 34.81,89.38 v1(34.81,99.79) ; 34.81,89.38 29.73,84.3 v1(29.73,84.04) v1(28.46,82.77) ; 34.81,89.38 38.11,86.07 41.42,86.07 58.69,68.8 63.01,68.8 89.68,42.13 117.11,42.13 v1(117.36,42.39) ; v1(214.69,57.24) v1(215.96,55.97) ; v1(210.33,75.97) v1(210.33,74.2) ; v1(207.02,94.99) v1(207.02,93.21) ; v1(154.03,83.27) U1.6 v1(165.21,94.45)
  Bottom Layer w0.254: SW2.1 34.81,106.06 v1(34.81,99.79) ; v1(215.96,55.97) 215.96,53.46 SW44.1 ; SW14.1 29.73,85.52 v1(29.73,84.04) ; v1(207.02,93.21) 207.02,81.82 ; v1(210.33,75.97) 207.03,79.28 SW20.1 ; v1(207.02,94.99) 203.72,98.29 SW8.1 178.19,100.58 172.83,95.21 165.97,95.21 v1(165.21,94.45) ; v1(117.36,42.39) 126.33,42.39 SW38.S2 133.44,45.43 133.44,66.75 148.95,82.26 153.02,82.26 v1(154.03,83.27) ; v1(210.33,74.2) 210.33,63.13 SW32.1 210.38,61.56 v1(214.69,57.24) ; 28.21,68.55 27.19,69.56 27.19,81.5 v1(28.46,82.77)
COL2: length 338.4
  Top Layer w0.254: v1(225.23,92.57) 222.95,90.29 187.74,90.29 185.61,92.42 172.66,92.42 171.39,91.15 v1(170.12,91.15) 171.64,89.62 v1(171.64,76.92) ; v1(225.23,92.57) v1(225.23,101.72) ; v1(225.23,92.57) 225.23,84.95 v1(228.28,81.91) ; v1(53.36,62.65) v1(51.33,64.69) ; v1(81.16,45.37) 89.79,36.73 93.86,36.73 95.38,38.25 99.7,38.25 100.97,36.98 129.16,36.98 134.5,31.65 141.35,31.65 v1(144.4,34.7) ; v1(165.54,66.26) 165.8,66 165.8,63.46 v1(151.57,49.24) ; v1(54.74,95.46) v1(54.74,98.25)
  Bottom Layer w0.254: 147.96,35.71 147.96,45.62 v1(151.57,49.24) ; 147.96,35.71 145.42,35.71 v1(144.4,34.7) ; 147.96,35.71 SW45.1 ; v1(54.74,95.46) 51.44,92.16 SW15.1 51.44,75.44 SW27.1 48.13,67.88 v1(51.33,64.69) ; v1(81.16,45.37) 80.9,45.11 76.33,45.11 74.04,47.4 71.12,47.4 SW39.1 v1(53.36,62.65) ; v1(225.23,101.72) 221.88,105.07 SW9.1 ; v1(54.74,98.25) 54.74,109.64 ; v1(228.28,81.91) 228.28,70.05 SW33.1 ; v1(225.23,92.57) SW21.1 ; v1(171.64,76.92) 172.66,75.91 172.66,73.37 v1(165.54,66.26) ; v1(170.12,91.15) U1.7
COL3: length 349.1
  Top Layer w0.254: v1(165.21,89.37) U1.8 158.97,83.13 v1(158.8,83.13) ; v1(74.12,104.02) 73.36,103.26 v1(73.36,94.88) ; v1(247.84,83.57) 244.54,86.88 v1(244.54,95.26) 244.54,96.02 244.28,96.27 v1(244.28,102.62) ; v1(183.75,93.94) 184,93.94 v1(197.21,107.15) ; v1(70.81,65.19) v1(77.67,58.33) ; v1(114.1,38.18) v1(149.91,73.99)
  Bottom Layer w0.254: v1(183.75,93.94) 183.5,94.2 180.45,94.2 175.62,89.37 v1(165.21,89.37) ; v1(73.36,94.88) 70.82,92.34 70.82,91.07 67.51,87.76 67.51,68.49 v1(70.81,65.19) ; v1(149.91,73.99) 151.94,73.99 158.8,80.85 v1(158.8,83.13) ; v1(77.67,58.33) 77.67,55.05 91.49,41.22 92,41.73 103.17,41.73 110.29,34.62 ; v1(247.84,83.57) 247.84,69.69 247.85,69.68 ; v1(197.21,107.15) 201.02,110.96 226.68,110.96 229.72,114.01 235.06,114.01 241.23,107.83 SW10.1 242.25,106.18 242.25,104.66 v1(244.28,102.62) ; v1(114.1,38.18) 110.54,34.62 110.29,34.62 ; v1(244.54,95.26) 244.54,88.44 ; 110.29,34.62 112.83,32.08 112.83,29.54 115.11,27.25 115.11,23.44 122.23,16.33 128.68,16.33 SW46.1 ; v1(74.12,104.02) 74.12,109.82
COL4: length 351.3
  Top Layer w0.254: 166.22,84.98 166.73,84.47 166.73,83.97 165.21,82.44 v1(163.87,82.44) ; 166.22,84.98 166.22,86.25 v1(168.26,88.28) ; 166.22,84.98 165.14,86.07 U1.9 ; v1(90.25,86.85) v1(91.27,87.87) ; v1(262.74,100.36) 262.74,97.06 v1(264.52,95.28) ; v1(232.52,103.52) 231.76,102.76 212.45,102.76 212.2,103.02 200.26,103.02 198.23,100.98 191.62,100.98 v1(183.75,93.11) ; v1(267.83,79.32) v1(267.83,71.44) ; v1(117.52,39.52) 117.89,39.52 v1(149.9,71.52) ; v1(94.41,55.01) v1(90.85,58.57)
  Bottom Layer w0.254: v1(90.25,86.85) 88.98,85.58 88.98,84.31 88.6,83.93 88.6,68.49 SW29.1 85.65,62.49 86.79,61.36 88.06,61.36 v1(90.85,58.57) ; 114.73,38.5 113.46,39.77 109.65,39.77 v1(94.41,55.01) ; 114.73,38.5 114.73,37.74 114.22,37.23 SW41.1 121.83,34.56 127.88,28.52 127.88,27.25 133.47,21.66 142.36,21.66 147.94,16.07 ; 114.73,38.5 116.51,38.5 v1(117.52,39.52) ; v1(163.87,82.44) 152.95,71.52 v1(149.9,71.52) ; v1(267.83,71.44) 267.83,66.15 ; v1(183.75,93.11) 183.24,93.62 180.45,93.62 175.11,88.28 v1(168.26,88.28) ; v1(232.52,103.52) 233.93,104.94 241.55,104.94 241.8,104.68 241.8,104.43 243.58,102.65 243.58,102.4 244.09,101.89 249.17,101.89 250.69,100.36 257.91,100.36 SW11.1 261.22,101.89 v1(262.74,100.36) ; v1(267.83,79.32) 264.52,82.62 SW23.1 ; v1(91.27,87.87) 91.27,102.05 SW5.1 ; v1(264.52,95.28) 264.52,84.91
COL5: length 371.2
  Top Layer w0.254: v1(145.14,86.21) 135.05,96.3 122.35,96.3 v1(121.59,95.54) 121.59,93.76 v1(112.95,85.13) ; v1(278.48,61.33) 268.83,51.68 233.52,51.68 207.62,25.77 v1(194.92,25.77) 194.15,26.53 194.15,32.63 179.17,47.61 179.17,67.93 v1(171.8,75.3) ; v1(106.1,75.2) v1(105.09,74.18)
  Bottom Layer w0.254: SW6.1 111.7,97.57 114.47,97.57 116.76,95.29 121.33,95.29 v1(121.58,95.54) ; SW12.1 279.99,105.45 283.8,101.64 287.1,101.64 287.61,101.13 287.61,92.53 SW24.1 283.3,86.69 287.11,82.88 290.41,82.88 290.92,82.37 290.92,73.77 SW36.1 v1(278.48,61.33) ; 164.45,83.41 163.94,83.92 153.27,83.92 149.97,87.22 146.16,87.22 v1(145.14,86.21) ; 164.45,83.41 164.45,82.65 v1(171.8,75.3) ; 164.45,83.41 U1.10 ; SW48.1 171.49,20.56 179.54,20.56 184.62,25.64 186.52,23.73 192.88,23.73 v1(194.91,25.77) ; v1(105.09,74.18) 105.09,60.05 SW30.1 ; v1(112.95,85.13) 112.95,83.06 SW18.1 107.37,76.46 v1(106.1,75.19)
D2: length 42.4
  Bottom Layer w0.254: U1.2 153.02,92.42 148.95,92.42 146.67,90.13 127.86,90.13 127.74,90.01
D3: length 70.1
  Top Layer w0.254: SW37.B 170.75,40.81 171.56,41.62 171.56,41.87 171.05,42.38 171.05,85.81 169.53,87.34 169.53,95.21 167.49,97.24 167.49,103.34 U1.1
DOUT: length 36.9
  Top Layer w0.254: J3.2 153.8,77.22 155.33,77.22 157.87,79.76 164.72,79.76 v1(169.8,84.84)
  Bottom Layer w0.254: v1(169.8,84.84) 169.04,85.6 169.04,86.36 169.8,87.12 182.92,87.12 183.11,86.93
NET-(D1-PAD2): length 11.7
  Bottom Layer w0.254: 23.32,100.38 24.9,101.95 24.9,105.33 SW1.2
NET-(D2-PAD2): length 12.6
  Top Layer w0.254: v1(43.17,98.45) 43.17,97.18 v1(42.92,96.93)
  Bottom Layer w0.254: D2.2 42.22,96.93 v1(42.91,96.93) ; v1(43.17,98.45) 42.91,98.71 42.91,100.48 47.99,105.56 47.99,106.33
NET-(D3-PAD2): length 11.7
  Bottom Layer w0.254: SW3.2 63.6,105.59 63.6,102.2 D3.2
NET-(D4-PAD2): length 11.8
  Bottom Layer w0.254: D4.2 81.46,100.85 81.46,103.48 87.3,109.32 SW4.2
NET-(D5-PAD2): length 11.9
  Bottom Layer w0.254: 99.44,93.97 99.44,96.54 105.46,102.56 SW5.2
NET-(D6-PAD2): length 11.7
  Bottom Layer w0.254: 117.83,87.21 117.83,89.77 123.6,95.55 SW6.2
NET-(D7-PAD2): length 11.5
  Bottom Layer w0.254: D7.2 195.44,96.19 197.85,98.6
NET-(D8-PAD2): length 11.5
  Bottom Layer w0.254: D8.2 213.6,102.92 SW8.2
NET-(D9-PAD2): length 11.5
  Bottom Layer w0.254: SW9.2 231.76,109.7 D9.2
NET-(D10-PAD2): length 11.5
  Bottom Layer w0.254: SW10.2 251.12,109.53 251.12,101.46
NET-(D11-PAD2): length 11.5
  Top Layer w0.254: v1(271.22,101.3) v1(271.22,100.03)
  Bottom Layer w0.254: 273.51,108.41 271.22,106.13 v1(271.22,101.3) ; D11.2 271.22,98.05 v1(271.22,100.03)
NET-(D12-PAD2): length 11.5
  Bottom Layer w0.254: 292.28,111.72 289.87,109.31 D12.2
NET-(D13-PAD2): length 11.7
  Bottom Layer w0.254: D13.2 20.07,81.67 20.07,84.29 25.91,90.13 SW13.2
NET-(D14-PAD2): length 11.7
  Bottom Layer w0.254: D14.2 38.85,78.34 38.85,80.96 44.69,86.8 44.69,87.57
NET-(D15-PAD2): length 11.7
  Bottom Layer w0.254: D15.2 58.77,81.92 58.77,84.54 64.61,90.38 SW15.2
NET-(D16-PAD2): length 11.7
  Bottom Layer w0.254: D16.2 78.15,82.09 78.15,84.72 83.99,90.56 SW16.2
NET-(D17-PAD2): length 11.7
  Bottom Layer w0.254: SW17.2 102.16,83.81 96.32,77.96 96.32,75.34 96.27,75.29
NET-(D18-PAD2): length 11.8
  Bottom Layer w0.254: SW18.2 120.55,76.98 114.45,70.88 114.45,68.57 114.4,68.52
NET-(D19-PAD2): length 11.5
  Bottom Layer w0.254: D19.2 198.74,77.42 SW19.2
NET-(D20-PAD2): length 11.5
  Bottom Layer w0.254: SW20.2 216.91,84.15 216.91,76.08
NET-(D21-PAD2): length 11.5
  Bottom Layer w0.254: D21.2 235.07,90.9 SW21.2
NET-(D22-PAD2): length 11.5
  Bottom Layer w0.254: 254.42,82.7 254.42,90.77 SW22.2
NET-(D23-PAD2): length 11.5
  Bottom Layer w0.254: D23.2 274.41,87.24 276.81,89.65
NET-(D24-PAD2): length 11.5
  Bottom Layer w0.254: D24.2 293.18,90.55 SW24.2
NET-(D25-PAD2): length 10.9
  Bottom Layer w0.254: SW25.2 22.6,71.37 16.84,65.61 D25.2
NET-(D26-PAD2): length 10.9
  Bottom Layer w0.254: 41.38,68.81 41.38,68.04 35.79,62.46 35.79,60.45 35.62,60.28
NET-(D27-PAD2): length 11
  Bottom Layer w0.254: D27.2 55.46,63.94 55.46,65.02 61.3,70.86 SW27.2
NET-(D28-PAD2): length 10.9
  Bottom Layer w0.254: D28.2 74.92,66.04 80.68,71.8 80.68,72.56
NET-(D29-PAD2): length 10.9
  Bottom Layer w0.254: SW29.2 98.83,65.04 93.09,59.3 D29.2
NET-(D30-PAD2): length 10.9
  Bottom Layer w0.254: SW30.2 116.99,58.28 111.23,52.52 D30.2
NET-(D31-PAD2): length 11.5
  Bottom Layer w0.254: SW31.2 202.05,58.66 D31.2
NET-(D32-PAD2): length 11.5
  Bottom Layer w0.254: 222.67,67.83 220.22,65.38 D32.2
NET-(D33-PAD2): length 11.5
  Bottom Layer w0.254: D33.2 238.38,72.18 SW33.2
NET-(D34-PAD2): length 11.5
  Bottom Layer w0.254: SW34.2 257.73,72.01 257.73,63.94
NET-(D35-PAD2): length 11.5
  Bottom Layer w0.254: 280.12,70.89 277.71,68.48 277.71,60.41
NET-(D36-PAD2): length 11.5
  Bottom Layer w0.254: SW36.2 296.49,71.79 D36.2
NET-(D37-PAD2): length 23.9
  Bottom Layer w0.254: D37.2 169.96,47.41 177.43,47.41 SW37.S1
NET-(D38-PAD2): length 24.8
  Top Layer w0.254: SW38.S1 134.72,51.7 v1(149.7,51.7)
  Bottom Layer w0.254: D38.2 150.44,51.7 v1(149.7,51.7)
NET-(D39-PAD2): length 11.8
  Bottom Layer w0.254: 77.03,37.08 77.03,39.37 83.04,45.39 SW39.2
NET-(D40-PAD2): length 11
  Bottom Layer w0.254: D40.2 103.5,38.06 SW40.2
NET-(D41-PAD2): length 11.3
  Bottom Layer w0.254: D41.2 116.47,23.63 117.63,23.63 122.2,28.2 SW41.2
NET-(D42-PAD2): length 12
  Bottom Layer w0.254: D42.2 194.41,27.2 194.41,34.37 SW42.2
NET-(D43-PAD2): length 10.8
  Bottom Layer w0.254: D43.2 216.24,32.44 SW43.2
NET-(D44-PAD2): length 11.5
  Bottom Layer w0.254: SW44.2 235.7,45.76 235.7,37.76
NET-(D45-PAD2): length 11.4
  Bottom Layer w0.254: D45.2 157.33,28.67 157.33,34.11 160.89,37.67
NET-(D46-PAD2): length 11.7
  Bottom Layer w0.254: D46.2 138.42,9.76 138.42,14.95 141.98,18.51
NET-(D47-PAD2): length 11.7
  Bottom Layer w0.254: D47.2 156.65,11.86 160.87,16.07 SW47.2
NET-(D48-PAD2): length 11.6
  Bottom Layer w0.254: D48.2 175.96,12.1 179.94,16.08 SW48.2
NET-(J2-PAD1): length 50.3
  Bottom Layer w0.254: SW_TOG1.2 195.95,102.84 SW49.2 195.44,106.26 192.27,106.26 192.02,106.51 191.26,106.51 189.99,105.24 164.08,105.24 162.81,106.51 152.14,106.51 JN.1
NET-(LED1-PAD2): length 66.3
  Bottom Layer w0.254: 72,97.19 80.89,97.19 91.05,87.03 113.4,87.03 114.67,85.76 124.32,85.76 126.35,87.79 130.24,87.79 132.02,86.01
NET-(LED2-PAD2): length 36.9
  Bottom Layer w0.254: 67.72,101.19 62.76,96.22 54.63,96.22 54.37,95.97 32.98,95.97
NET-(LED3-PAD2): length 21.2
  Bottom Layer w0.254: LED4.4 28.64,84.98 28.64,94.64 26.86,96.41 26.86,98.12 28.71,99.97
NET-(LED4-PAD2): length 43.7
  Top Layer w0.254: v1(58.81,58.12) 56.78,58.12 v1(50.18,64.73)
  Bottom Layer w0.254: v1(50.18,64.72) 39,75.9 31.38,75.9 LED4.2 ; LED5.4 64.68,57.76 59.17,57.76 v1(58.81,58.12)
NET-(LED5-PAD2): length 63.9
  Top Layer w0.254: v1(111.85,42.92) v1(98.39,56.38)
  Bottom Layer w0.254: LED5.2 62.49,60.19 85.94,60.19 90.01,56.13 98.14,56.13 v1(98.39,56.38) ; LED6.4 114.9,39.87 v1(111.85,42.92)
NET-(LED6-PAD2): length 28.4
  Bottom Layer w0.254: LED6.2 110.9,43.85 112.85,43.85 114.63,42.07 115.9,42.07 128.86,29.12 LED7.4
NET-(LED7-PAD2): length 36.5
  Top Layer w0.254: v1(154.33,28.71) 154.08,28.46 v1(149.25,28.46)
  Bottom Layer w0.254: 138.08,25.92 146.71,25.92 v1(149.25,28.46) ; v1(154.33,28.71) 156.11,26.94 170.04,26.94 LED8.4
NET-(LED8-PAD2): length 29
  Bottom Layer w0.254: LED8.2 190.04,38.84 197.78,38.84 LED9.4
NET-(LED10-PAD2): length 44.8
  Bottom Layer w0.254: LED10.2 244.56,60.94 249.64,60.94 253.2,64.5 255.74,64.5 257.26,62.98 258.28,62.98 272.76,77.45 276.16,77.45 279.54,80.83
NET-(LED10-PAD4): length 68.7
  Bottom Layer w0.254: LED9.2 198.08,42.94 198.34,42.69 211.64,42.69 213.88,44.93 216.92,44.93 221.75,40.1 228.86,40.1 229.62,40.86 229.62,41.88 231.15,43.4 231.15,46.45 234.7,50.01 240.8,50.01 LED10.4
NET-(LED11-PAD2): length 20.3
  Bottom Layer w0.254: LED12.4 281.69,89.37 281.44,89.12 281.44,86.32 285.5,82.26 285.5,79.11 LED11.2
NET-(LED12-PAD2): length 35.4
  Bottom Layer w0.254: LED13.4 244.59,96.32 273.52,96.32 LED12.2
NET-(LED13-PAD2): length 65.4
  Top Layer w0.254: v1(224.46,99.9) 220.4,95.83 v1(194.24,95.83)
  Bottom Layer w0.254: v1(194.24,95.83) 192.97,95.83 190.68,93.55 190.68,92.53 188.65,90.5 187.38,90.5 186.87,91.01 179.51,91.01 177.73,89.23 ; 237.45,100.39 236.96,99.9 v1(224.46,99.9)
RAW: length 62.7
  Bottom Layer w0.254: SW49.3 193.02,104.1 194.29,102.83 ; U1.24 150.5,107.66 181.23,107.66 183.01,105.88 189.87,105.88 191.14,107.15 192.15,107.15 193.17,108.17 194.79,108.17 196.75,106.21 196.75,103.67 197.33,103.09 197.33,102.07 196.57,101.31 195.81,101.31 194.29,102.83 ; SW_TOG1.1 194.29,102.6 194.29,102.83
ROW0: length 162.2
  Top Layer w0.254: v1(80.5,101.34) 84,97.85 v1(92.89,97.85)
  Bottom Layer w0.254: 42.26,98.41 42.26,99.42 41.76,99.93 40.49,99.93 38.96,101.45 38.96,103.74 39.98,104.76 39.98,106.28 38.45,107.8 32.36,107.8 23.98,99.42 21.59,99.42 D1.1 ; 42.26,98.41 39.64,98.41 D2.1 ; 42.26,98.41 43.03,97.64 55.22,97.64 D3.1 60.3,99.68 62.58,99.68 67.8,104.9 72.37,104.9 75.93,101.34 D4.1 v1(80.5,101.34) ; U1.20 144.15,91.15 127.13,91.15 122.23,86.25 116.1,86.25 D6.1 102.95,87.78 D5.1 v1(92.89,97.85)
ROW1: length 157.3
  Top Layer w0.254: U1.19 149.48,93.69 v1(151.51,91.66)
  Bottom Layer w0.254: D12.1 286.62,100.66 283.34,100.66 280.3,103.71 276.74,103.71 273.69,100.66 270.9,100.66 267.85,97.61 267.85,97.36 251.4,97.36 D10.1 247.11,100.13 241.72,100.13 240.96,100.89 240.96,101.81 238.42,104.35 237.15,104.35 233.34,100.54 229.02,100.54 D9.1 221.45,101.05 214.16,93.76 210.86,93.76 210.35,94.27 204.25,94.27 197.01,87.03 192.7,87.03 D7.1 190.92,88.81 185.35,88.81 184.59,88.05 182.56,88.05 182.05,87.54 155.63,87.54 v1(151.51,91.66)
ROW2: length 156.5
  Top Layer w0.254: v1(29.96,82.16) v1(23.61,82.16) ; v1(89.2,79.42) v1(87.93,80.69) ; v1(71.54,82.62) 57.57,82.62 57.4,82.44 v1(57.14,82.44) 54.09,82.44 v1(50.54,78.88)
  Bottom Layer w0.254: v1(29.96,82.16) 32.24,82.16 D14.1 37.3,77.11 48.76,77.11 v1(50.54,78.88) ; v1(23.61,82.16) 22.08,80.64 18.31,80.64 D13.1 ; v1(89.2,79.42) 92.76,75.86 D17.1 94.7,74.17 97.69,74.17 98.45,74.94 105.31,74.94 D18.1 112.72,67.53 125.6,67.53 U1.18 ; v1(57.14,82.44) 55.47,82.44 ; v1(87.93,80.69) 76.78,80.69 D16.1 v1(71.54,82.62)
ROW3: length 162
  Top Layer w0.254: v1(280.3,81.9) v1(286.14,81.9) ; v1(237.57,82.13) v1(238.84,82.13)
  Bottom Layer w0.254: D24.1 289.92,81.9 v1(286.14,81.9) ; v1(237.57,82.13) 237.32,81.87 232.24,81.87 231.56,82.54 228.06,82.54 220.52,75 214.16,75 213.66,75.51 213.53,75.38 206.42,75.38 199.3,68.27 196,68.27 D19.1 194.21,70.07 191.9,70.07 190.63,68.8 180.72,68.8 164.72,84.8 153.04,84.8 U1.17 ; v1(238.84,82.13) 241.13,84.41 248.89,84.41 D22.1 254.7,78.6 D23.1 271.66,78.09 274.97,78.09 278.77,81.9 v1(280.3,81.9)
ROW4: length 191
  Top Layer w0.254: v1(66.34,64.61) 61.26,64.61 61.08,64.43 v1(60.82,64.43) 59.81,65.45 49.9,65.45 v1(48.63,64.18)
  Bottom Layer w0.254: v1(48.63,64.18) 42.28,64.18 37.2,59.1 34.12,59.1 32.37,60.85 16.91,60.85 13.59,64.18 ; D27.1 53.46,64.43 54.98,62.91 56,62.91 57.52,64.43 v1(60.82,64.43) ; U1.16 112.65,49.49 109.57,49.49 D30.1 100.7,58.36 100.7,66.74 99.24,68.21 94.75,68.21 89.78,63.23 89.78,60.59 91.56,58.81 91.56,58.3 91.11,57.85 D29.1 86.79,60.9 75.38,60.9 D28.1 v1(66.34,64.61)
ROW5: length 176.5
  Top Layer w0.254: v1(164.98,64.48) 151.77,77.69 151.77,80.99 U1.15
  Bottom Layer w0.254: D36.1 289.42,59.33 274.97,59.33 D35.1 272.24,59.84 267.69,64.38 264.9,64.38 262.87,62.35 255.5,62.35 254.48,63.37 251.44,60.32 248.75,60.32 245.45,57.02 241.64,57.02 D33.1 227.84,56.24 217.48,56.24 216.97,56.75 216.84,56.62 209.73,56.62 202.61,49.51 199.31,49.51 D31.1 179.44,50.02 v1(164.98,64.48)
ROW6: length 188.1
  Top Layer w0.254: v1(114.43,25.11) 120.52,25.11 121.54,26.12 130.94,26.12 v1(135.76,30.95) ; v1(171.06,37.43) v1(185.03,23.46)
  Bottom Layer w0.254: v1(135.76,30.95) 136.02,30.95 144.15,39.08 144.15,45.17 148.97,50 ; D39.1 79.18,32.25 D40.1 99.92,25.63 D41.1 114.35,25.11 v1(114.43,25.11) ; v1(185.03,23.46) 185.26,23.22 193.74,23.22 ; U1.14 147.19,78.96 147.19,51.78 ; 148.97,50 159.25,50 D37.1 161.66,46.82 v1(171.06,37.43) ; 148.97,50 147.19,51.78 ; 147.19,51.78 D38.1
ROW7: length 185.6
  Top Layer w0.254: v1(153.35,26.82) v1(153.35,25.04) ; U1.13 149.23,75.65 150.5,74.38 150.5,45.17 v1(150.24,44.92)
  Bottom Layer w0.254: D44.1 226.17,30.9 213.43,30.9 190.21,7.68 173.67,7.68 D48.1 171.74,7.77 154.37,7.77 153.35,8.79 ; v1(153.35,26.82) 153.35,28.09 152.53,28.92 152.53,33.49 153.29,34.25 153.29,41.87 v1(150.24,44.92) ; D46.1 135.07,7.68 152.34,7.68 D47.1 153.35,8.79 ; 153.35,8.79 153.35,9.29 152.59,10.06 152.59,14.37 153.35,15.14 v1(153.35,25.04)
RST: length 32.5
  Bottom Layer w0.254: 149.23,101.31 144.66,105.87 Reset1.1

## Copper pours and planes (outline as drawn; the poured copper is in the pictures)
VCC on Bottom Layer: 133.41,88.6 133.34,88.69 133.28,88.76 133.23,88.83 133.19,88.89 133.16,88.95 133.14,89.02 133.12,89.08 133.07,89.24 133.04,89.33 132.39,89.34 132.41,88.69 132.5,88.66 132.65,88.62 132.72,88.59 132.78,88.57 132.84,88.54 132.91,88.51 132.98,88.46 133.05,88.4 133.13,88.32
B4 on Bottom Layer: 163.7,79.97 163.57,80.12 163.46,80.25 163.38,80.38 163.32,80.49 163.27,80.6 163.22,80.71 163.16,80.82 163.09,80.93 163,81.05 162.88,81.19 161.98,80.76 162.46,79.89 162.59,79.92 162.71,79.95 162.82,79.98 162.93,80 163.02,80.01 163.12,80.01 163.22,80 163.31,79.96 163.42,79.89 163.53,79.79
B5 on Bottom Layer: 162.54,76.59 162.55,76.77 162.58,76.93 162.62,77.05 162.67,77.16 162.72,77.26 162.79,77.36 162.86,77.46 162.92,77.57 162.99,77.69 163.06,77.85 162.3,78.49 161.69,77.71 161.78,77.58 161.87,77.47 161.95,77.38 162.03,77.29 162.1,77.21 162.17,77.12 162.22,77.02 162.26,76.9 162.28,76.76 162.29,76.59
COL1 on Bottom Layer: 163.86,93.47 163.68,93.48 163.54,93.51 163.41,93.55 163.31,93.6 163.22,93.66 163.13,93.73 163.03,93.8 162.93,93.88 162.81,93.96 162.67,94.03 161.96,93.35 162.67,92.66 162.81,92.74 162.93,92.82 163.03,92.89 163.13,92.97 163.22,93.04 163.31,93.1 163.41,93.15 163.54,93.19 163.68,93.21 163.86,93.22
COL1 on Bottom Layer: 160.88,93.64 161,93.52 161.11,93.42 161.2,93.34 161.28,93.27 161.44,93.14 161.51,93.08 161.6,93 161.69,92.91 161.8,92.81 162.72,93.35 162.01,94.03 161.9,93.97 161.79,93.91 161.7,93.84 161.61,93.78 161.52,93.73 161.43,93.69 161.34,93.68 161.25,93.69 161.16,93.74 161.06,93.82
COL2 on Bottom Layer: 160.99,91.52 161.13,91.37 161.24,91.23 161.31,91.11 161.37,90.99 161.42,90.88 161.47,90.77 161.52,90.65 161.59,90.53 161.68,90.41 161.79,90.28 162.7,90.68 162.26,91.57 162.13,91.55 162,91.52 161.89,91.5 161.78,91.48 161.68,91.47 161.59,91.47 161.49,91.49 161.39,91.53 161.28,91.6 161.17,91.7
COL5 on Bottom Layer: 161.18,84.18 161.3,84.04 161.38,83.92 161.44,83.81 161.48,83.7 161.5,83.59 161.52,83.48 161.53,83.36 161.55,83.23 161.57,83.09 161.62,82.94 162.61,82.92 162.59,83.91 162.44,83.95 162.3,83.98 162.17,84 162.05,84.01 161.94,84.03 161.83,84.05 161.72,84.09 161.61,84.15 161.49,84.23 161.35,84.35
D3 on Top Layer: 163.5,105.06 163.38,105.19 163.3,105.31 163.24,105.43 163.2,105.54 163.18,105.65 163.16,105.76 163.15,105.88 163.13,106 163.11,106.14 163.06,106.3 162.07,106.32 162.09,105.33 162.25,105.28 162.38,105.25 162.51,105.24 162.63,105.22 162.74,105.21 162.85,105.19 162.96,105.15 163.07,105.09 163.2,105 163.33,104.88
NET-(D34-PAD2) on Bottom Layer: 258.76,72.55 258.79,72.79 258.87,72.96 258.99,73.07 259.16,73.13 259.35,73.15 259.57,73.15 259.81,73.15 260.06,73.16 260.31,73.18 260.55,73.24 260.58,74.87 258.89,74.42 258.88,74.19 258.85,73.99 258.81,73.82 258.76,73.67 258.7,73.53 258.64,73.38 258.59,73.21 258.55,73.03 258.52,72.81 258.51,72.55
NET-(J2-PAD1) on Top Layer: 151.89,106.66 151.74,106.52 151.6,106.41 151.48,106.33 151.36,106.27 151.24,106.23 151.12,106.19 150.99,106.16 150.85,106.13 150.7,106.09 150.53,106.04 150.49,104.87 151.65,104.87 151.71,105.04 151.76,105.19 151.79,105.33 151.83,105.46 151.87,105.58 151.91,105.7 151.98,105.82 152.06,105.95 152.17,106.08 152.31,106.24
NET-(LED1-PAD2) on Bottom Layer: 131.03,85.89 131.14,85.88 131.24,85.87 131.32,85.85 131.38,85.82 131.45,85.78 131.51,85.74 131.63,85.66 131.71,85.61 131.8,85.56 132.27,86.01 131.8,86.46 131.71,86.41 131.63,86.37 131.51,86.28 131.45,86.24 131.38,86.2 131.32,86.18 131.24,86.15 131.14,86.14 131.03,86.14
NET-(LED11-PAD2) on Bottom Layer: 281.82,95.83 281.82,95.94 281.84,96.04 281.86,96.12 281.89,96.19 281.92,96.25 281.96,96.31 282.05,96.44 282.1,96.51 282.14,96.6 281.69,97.07 281.24,96.6 281.29,96.51 281.34,96.44 281.43,96.31 281.47,96.25 281.5,96.19 281.53,96.12 281.55,96.04 281.57,95.94 281.57,95.83
